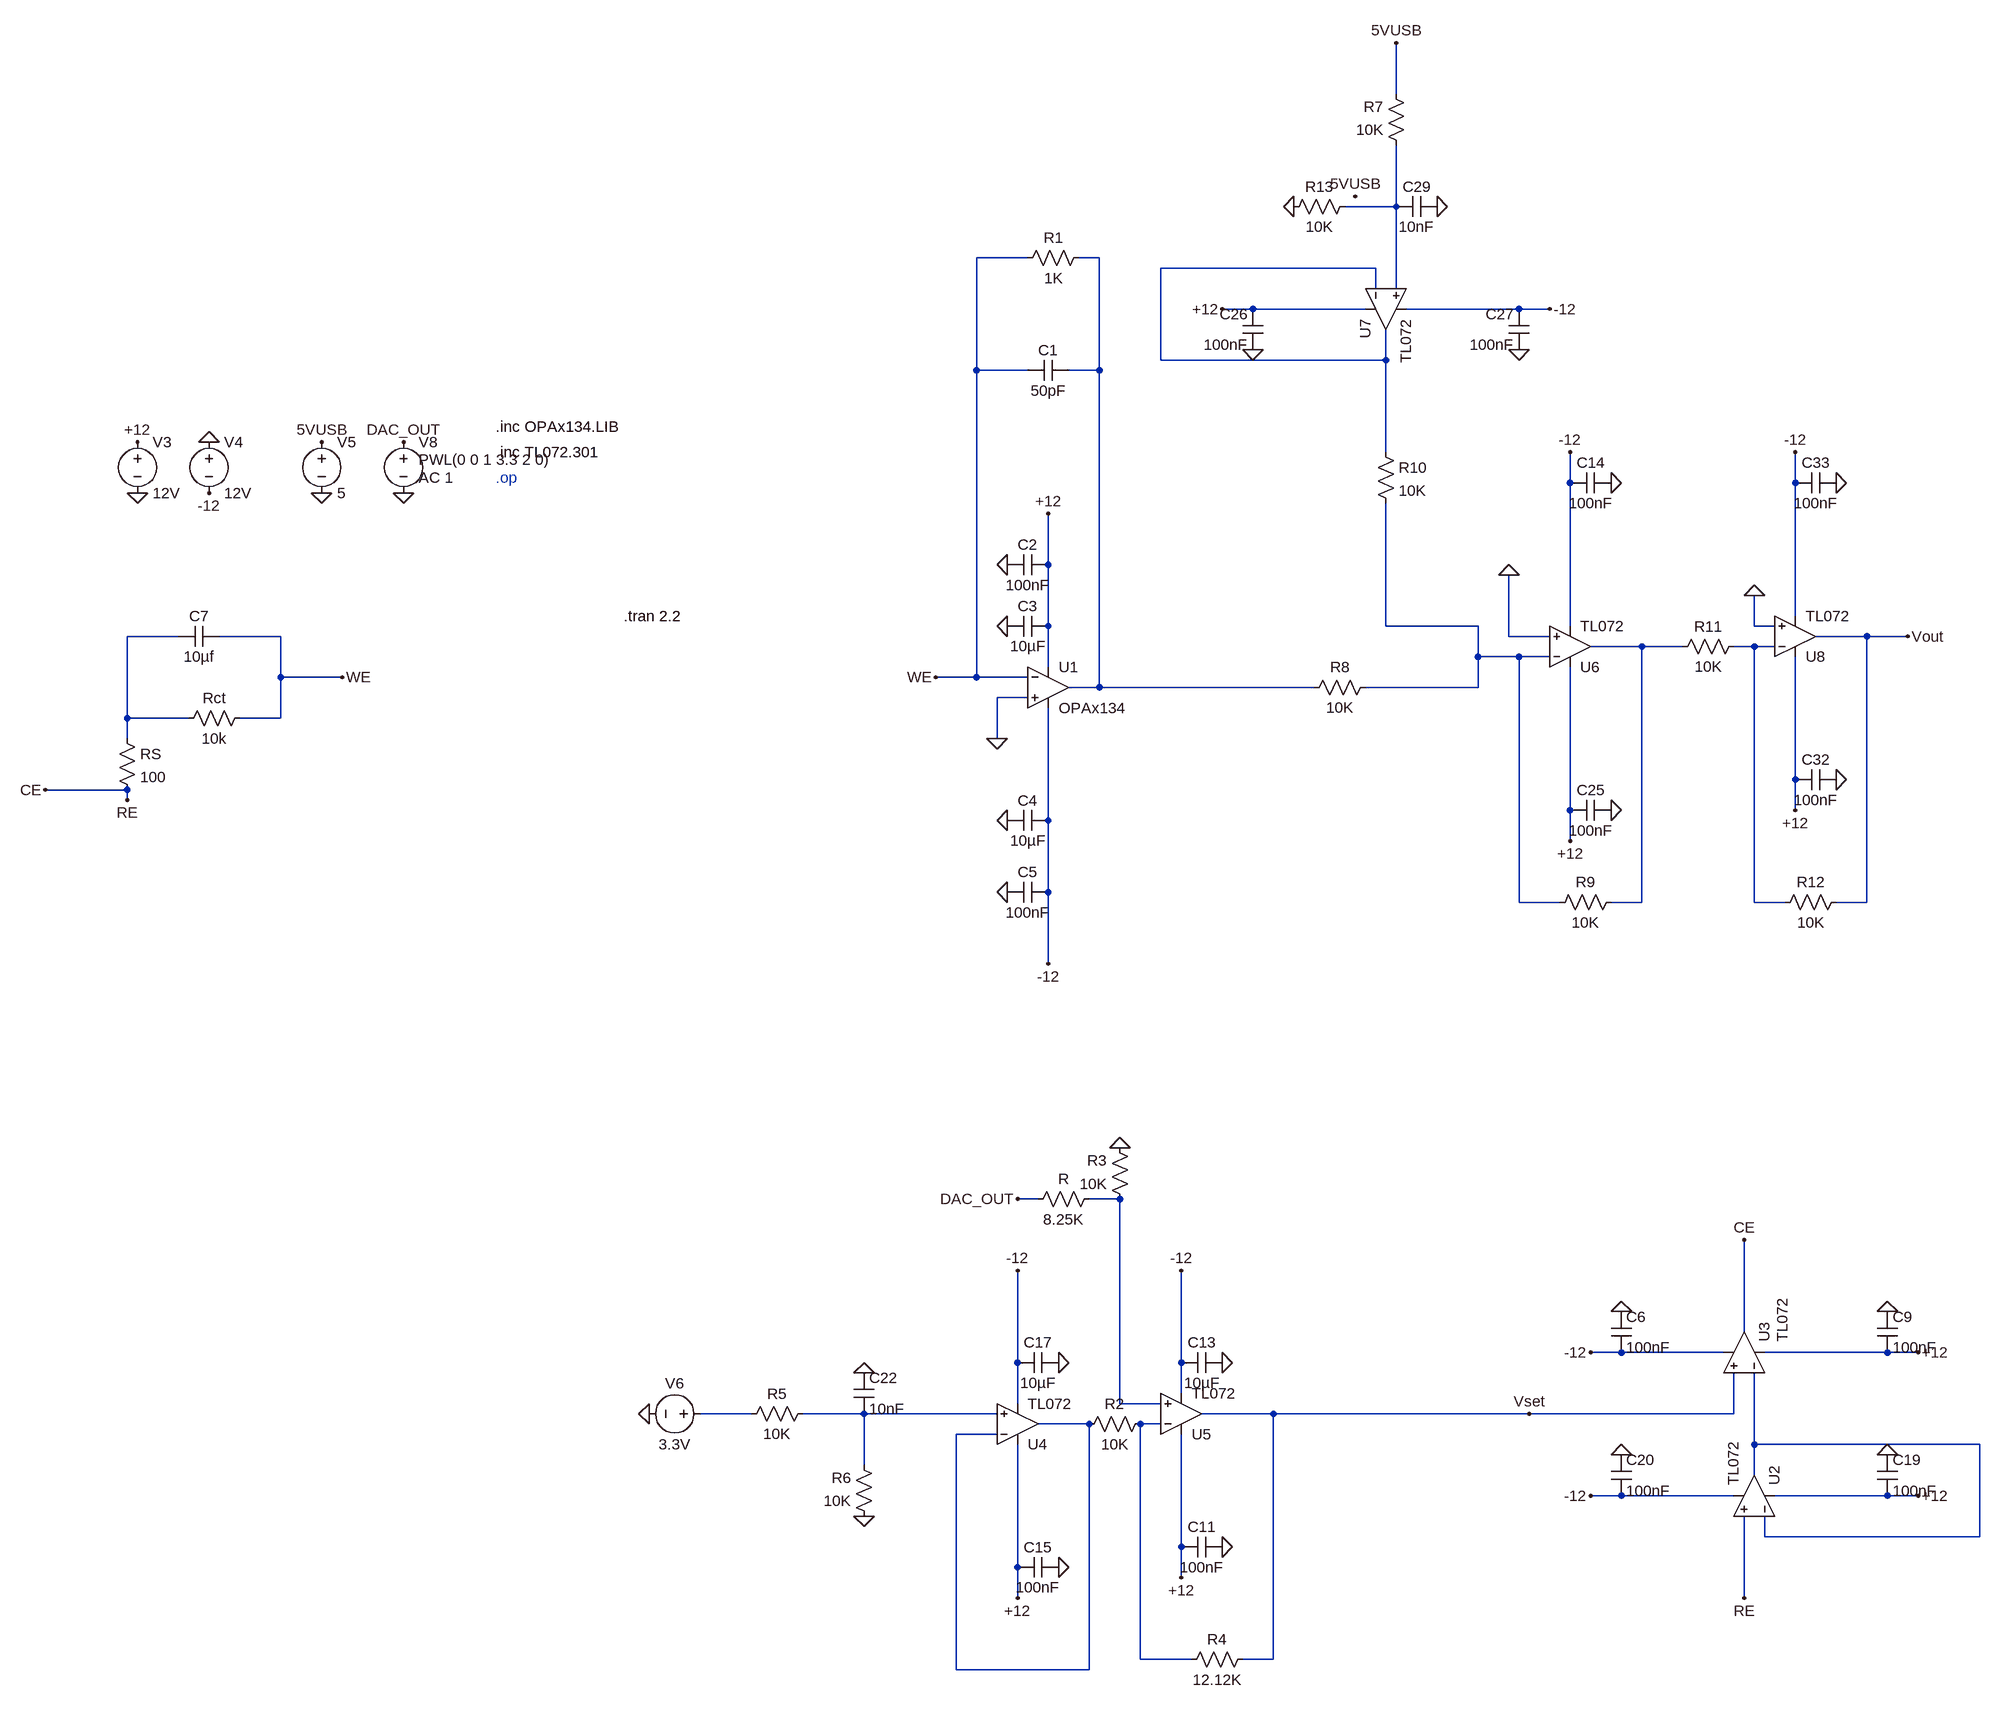
[diagram p0: schematic RandlesCell_DC_2.asc]
RandlesCell_DC_2.asc, the LTspice schematic file:
Version 4.1
SHEET 1 3064 1480
WIRE 1072 -1200 1072 -1280
WIRE 1072 -1024 1072 -1120
WIRE 1072 -1024 992 -1024
WIRE 496 -944 416 -944
WIRE 608 -944 576 -944
WIRE 1040 -928 704 -928
WIRE 1040 -896 1040 -928
WIRE 1072 -896 1072 -1024
WIRE 848 -864 800 -864
WIRE 1024 -864 848 -864
WIRE 1264 -864 1088 -864
WIRE 1312 -864 1264 -864
WIRE 704 -784 704 -928
WIRE 1056 -784 1056 -832
WIRE 1056 -784 704 -784
WIRE 416 -768 416 -944
WIRE 496 -768 416 -768
WIRE 608 -768 608 -944
WIRE 608 -768 560 -768
WIRE 1056 -640 1056 -784
WIRE 1344 -592 1344 -640
WIRE 1696 -592 1696 -640
WIRE 528 -464 528 -544
WIRE 1696 -384 1696 -592
WIRE 528 -368 528 -464
WIRE 1056 -368 1056 -560
WIRE 1200 -368 1056 -368
WIRE 1344 -368 1344 -592
WIRE 1632 -368 1632 -416
WIRE 1664 -368 1632 -368
WIRE -832 -352 -912 -352
WIRE -672 -352 -768 -352
WIRE 1248 -352 1248 -448
WIRE 1312 -352 1248 -352
WIRE 1808 -352 1728 -352
WIRE 1872 -352 1808 -352
WIRE 1456 -336 1376 -336
WIRE 1520 -336 1456 -336
WIRE 1632 -336 1600 -336
WIRE 1664 -336 1632 -336
WIRE 1200 -320 1200 -368
WIRE 1264 -320 1200 -320
WIRE 1312 -320 1264 -320
WIRE 528 -304 528 -368
WIRE -672 -288 -672 -352
WIRE -576 -288 -672 -288
WIRE 416 -288 416 -768
WIRE 416 -288 352 -288
WIRE 496 -288 416 -288
WIRE 608 -272 608 -768
WIRE 608 -272 560 -272
WIRE 944 -272 608 -272
WIRE 1200 -272 1200 -320
WIRE 1200 -272 1024 -272
WIRE 496 -256 448 -256
WIRE -912 -224 -912 -352
WIRE -816 -224 -912 -224
WIRE -672 -224 -672 -288
WIRE -672 -224 -736 -224
WIRE -912 -192 -912 -224
WIRE 448 -192 448 -256
WIRE 1696 -128 1696 -320
WIRE -912 -112 -1040 -112
WIRE -912 -96 -912 -112
WIRE 1344 -80 1344 -304
WIRE 1696 -80 1696 -128
WIRE 528 -64 528 -240
WIRE 1344 -32 1344 -80
WIRE 528 48 528 -64
WIRE 1264 64 1264 -320
WIRE 1328 64 1264 64
WIRE 1456 64 1456 -336
WIRE 1456 64 1408 64
WIRE 1632 64 1632 -336
WIRE 1680 64 1632 64
WIRE 1808 64 1808 -352
WIRE 1808 64 1760 64
WIRE 528 160 528 48
WIRE 512 528 480 528
WIRE 640 528 592 528
WIRE 1616 736 1616 592
WIRE 1424 768 1376 768
WIRE 1584 768 1424 768
WIRE 1840 768 1648 768
WIRE 1888 768 1840 768
WIRE 480 784 480 640
WIRE 736 784 736 640
WIRE 736 832 736 784
WIRE 480 848 480 784
WIRE 640 848 640 528
WIRE 704 848 640 848
WIRE 64 864 -16 864
WIRE 240 864 144 864
WIRE 448 864 240 864
WIRE 880 864 768 864
WIRE 1280 864 880 864
WIRE 1600 864 1600 800
WIRE 1600 864 1280 864
WIRE 592 880 512 880
WIRE 704 880 672 880
WIRE 448 896 384 896
WIRE 1632 912 1632 800
WIRE 1984 912 1632 912
WIRE 240 944 240 864
WIRE 1632 960 1632 912
WIRE 1424 992 1376 992
WIRE 1600 992 1424 992
WIRE 1840 992 1664 992
WIRE 1888 992 1840 992
WIRE 1648 1056 1648 1024
WIRE 1984 1056 1984 912
WIRE 1984 1056 1648 1056
WIRE 736 1072 736 896
WIRE 480 1104 480 912
WIRE 736 1120 736 1072
WIRE 480 1152 480 1104
WIRE 1616 1152 1616 1024
WIRE 672 1248 672 880
WIRE 752 1248 672 1248
WIRE 880 1248 880 864
WIRE 880 1248 832 1248
WIRE 384 1264 384 896
WIRE 592 1264 592 880
WIRE 592 1264 384 1264
FLAG 464 -464 0
FLAG 464 -368 0
FLAG 464 -64 0
FLAG 464 48 0
FLAG 1376 768 -12
FLAG 1888 768 +12
FLAG 1616 1152 RE
FLAG 1616 592 CE
FLAG -896 -576 0
FLAG -784 -656 0
FLAG -896 -656 +12
FLAG -784 -576 -12
FLAG 736 1120 +12
FLAG 736 640 -12
FLAG 480 1152 +12
FLAG 480 640 -12
FLAG 1888 992 +12
FLAG 1376 992 -12
FLAG 480 528 DAC_OUT
FLAG 640 448 0
FLAG -96 864 0
FLAG 240 1024 0
FLAG 240 800 0
FLAG -480 -576 0
FLAG -480 -656 DAC_OUT
FLAG 1424 928 0
FLAG 1424 704 0
FLAG 1840 704 0
FLAG 1840 928 0
FLAG 800 784 0
FLAG 800 1072 0
FLAG 544 1104 0
FLAG 544 784 0
FLAG 448 -192 0
FLAG -608 -576 0
FLAG -608 -656 5VUSB
FLAG 1344 -640 -12
FLAG 1408 -592 0
FLAG 1344 -32 +12
FLAG 1408 -80 0
FLAG 1248 -448 0
FLAG 1632 -416 0
FLAG 1872 -352 Vout
FLAG 1696 -80 +12
FLAG 1760 -128 0
FLAG 1696 -640 -12
FLAG 1760 -592 0
FLAG 800 -864 +12
FLAG 1312 -864 -12
FLAG 1264 -800 0
FLAG 848 -800 0
FLAG 912 -1024 0
FLAG 1136 -1024 0
FLAG 1008 -1040 5VUSB
FLAG 1072 -1280 5VUSB
FLAG 352 -288 WE
FLAG -576 -288 WE
FLAG -912 -96 RE
FLAG 1280 864 Vset
FLAG 528 160 -12
FLAG 528 -544 +12
FLAG -1040 -112 CE
SYMBOL cap 560 -784 R90
WINDOW 0 0 32 VBottom 2
WINDOW 3 32 32 VTop 2
SYMATTR InstName C1
SYMATTR Value 50pF
SYMBOL res 592 -960 R90
WINDOW 0 0 56 VBottom 2
WINDOW 3 32 56 VTop 2
SYMATTR InstName R1
SYMATTR Value 1K
SYMBOL cap 528 -480 R90
WINDOW 0 0 32 VBottom 2
WINDOW 3 32 32 VTop 2
SYMATTR InstName C2
SYMATTR Value 100nF
SYMBOL cap 528 -384 R90
WINDOW 0 0 32 VBottom 2
WINDOW 3 32 32 VTop 2
SYMATTR InstName C3
SYMATTR Value 10µF
SYMBOL cap 528 -80 R90
WINDOW 0 0 32 VBottom 2
WINDOW 3 32 32 VTop 2
SYMATTR InstName C4
SYMATTR Value 10µF
SYMBOL cap 528 32 R90
WINDOW 0 0 32 VBottom 2
WINDOW 3 32 32 VTop 2
SYMATTR InstName C5
SYMATTR Value 100nF
SYMBOL OpAmps\\opamp2 528 -336 R0
SYMATTR InstName U1
SYMATTR Value OPAx134
SYMBOL OpAmps\\opamp2 1696 992 M270
SYMATTR InstName U2
SYMATTR Value TL072
SYMBOL OpAmps\\opamp2 1680 768 M270
WINDOW 3 16 4 Left 2
SYMATTR Value TL072
SYMATTR InstName U3
SYMBOL voltage -896 -672 R0
WINDOW 123 0 0 Left 0
WINDOW 39 0 0 Left 0
SYMATTR InstName V3
SYMATTR Value 12V
SYMBOL voltage -784 -672 R0
SYMATTR InstName V4
SYMATTR Value 12V
SYMBOL cap 1408 704 R0
SYMATTR InstName C6
SYMATTR Value 100nF
SYMBOL cap 1824 704 R0
SYMATTR InstName C9
SYMATTR Value 100nF
SYMBOL OpAmps\\opamp2 480 944 M180
SYMATTR InstName U4
SYMATTR Value TL072
SYMBOL OpAmps\\opamp2 736 928 M180
SYMATTR InstName U5
SYMATTR Value TL072
SYMBOL cap 800 1056 R90
WINDOW 0 0 32 VBottom 2
WINDOW 3 32 32 VTop 2
SYMATTR InstName C11
SYMATTR Value 100nF
SYMBOL cap 800 768 R90
WINDOW 0 0 32 VBottom 2
WINDOW 3 32 32 VTop 2
SYMATTR InstName C13
SYMATTR Value 10µF
SYMBOL cap 544 1088 R90
WINDOW 0 0 32 VBottom 2
WINDOW 3 32 32 VTop 2
SYMATTR InstName C15
SYMATTR Value 100nF
SYMBOL cap 544 768 R90
WINDOW 0 0 32 VBottom 2
WINDOW 3 32 32 VTop 2
SYMATTR InstName C17
SYMATTR Value 10µF
SYMBOL cap 1824 928 R0
SYMATTR InstName C19
SYMATTR Value 100nF
SYMBOL cap 1408 928 R0
SYMATTR InstName C20
SYMATTR Value 100nF
SYMBOL res 608 512 R90
WINDOW 0 0 56 VBottom 2
WINDOW 3 32 56 VTop 2
SYMATTR InstName R
SYMATTR Value 8.25K
SYMBOL res 656 544 R180
WINDOW 0 36 76 Left 2
WINDOW 3 36 40 Left 2
SYMATTR InstName R3
SYMATTR Value 10K
SYMBOL res 688 864 R90
WINDOW 0 0 56 VBottom 2
WINDOW 3 32 56 VTop 2
SYMATTR InstName R2
SYMATTR Value 10K
SYMBOL res 848 1232 R90
WINDOW 0 0 56 VBottom 2
WINDOW 3 32 56 VTop 2
SYMATTR InstName R4
SYMATTR Value 12.12K
SYMBOL voltage 0 864 R90
WINDOW 0 -32 56 VBottom 2
WINDOW 3 32 56 VTop 2
WINDOW 123 0 0 Left 0
WINDOW 39 0 0 Left 0
SYMATTR InstName V6
SYMATTR Value 3.3V
SYMBOL res 160 848 R90
WINDOW 0 0 56 VBottom 2
WINDOW 3 32 56 VTop 2
SYMATTR InstName R5
SYMATTR Value 10K
SYMBOL res 256 1040 R180
WINDOW 0 36 76 Left 2
WINDOW 3 36 40 Left 2
SYMATTR InstName R6
SYMATTR Value 10K
SYMBOL cap 224 800 R0
SYMATTR InstName C22
SYMATTR Value 10nF
SYMBOL res -720 -240 R90
WINDOW 0 0 56 VBottom 2
WINDOW 3 32 56 VTop 2
SYMATTR InstName Rct
SYMATTR Value 10k
SYMBOL voltage -480 -672 R0
WINDOW 3 24 44 Left 2
WINDOW 123 24 72 Left 2
WINDOW 39 0 0 Left 0
SYMATTR Value PWL(0 0 1 3.3 2 0)
SYMATTR Value2 AC 1
SYMATTR InstName V8
SYMBOL OpAmps\\opamp2 1344 -272 M180
SYMATTR InstName U6
SYMATTR Value TL072
SYMBOL voltage -608 -672 R0
WINDOW 123 0 0 Left 0
WINDOW 39 0 0 Left 0
SYMATTR InstName V5
SYMATTR Value 5
SYMBOL cap 1408 -608 R90
WINDOW 0 0 32 VBottom 2
WINDOW 3 32 32 VTop 2
SYMATTR InstName C14
SYMATTR Value 100nF
SYMBOL cap 1408 -96 R90
WINDOW 0 0 32 VBottom 2
WINDOW 3 32 32 VTop 2
SYMATTR InstName C25
SYMATTR Value 100nF
SYMBOL res 1424 48 R90
WINDOW 0 0 56 VBottom 2
WINDOW 3 32 56 VTop 2
SYMATTR InstName R9
SYMATTR Value 10K
SYMBOL res 1504 -320 R270
WINDOW 0 32 56 VTop 2
WINDOW 3 0 56 VBottom 2
SYMATTR InstName R11
SYMATTR Value 10K
SYMBOL OpAmps\\opamp2 1696 -288 M180
SYMATTR InstName U8
SYMATTR Value TL072
SYMBOL res 1664 80 R270
WINDOW 0 32 56 VTop 2
WINDOW 3 0 56 VBottom 2
SYMATTR InstName R12
SYMATTR Value 10K
SYMBOL cap 1760 -144 R90
WINDOW 0 0 32 VBottom 2
WINDOW 3 32 32 VTop 2
SYMATTR InstName C32
SYMATTR Value 100nF
SYMBOL cap 1760 -608 R90
WINDOW 0 0 32 VBottom 2
WINDOW 3 32 32 VTop 2
SYMATTR InstName C33
SYMATTR Value 100nF
SYMBOL res 1040 -288 R90
WINDOW 0 0 56 VBottom 2
WINDOW 3 32 56 VTop 2
SYMATTR InstName R8
SYMATTR Value 10K
SYMBOL OpAmps\\opamp2 992 -864 M90
SYMATTR InstName U7
SYMATTR Value TL072
SYMBOL cap 864 -800 R180
WINDOW 0 24 56 Left 2
WINDOW 3 24 8 Left 2
SYMATTR InstName C26
SYMATTR Value 100nF
SYMBOL cap 1280 -800 R180
WINDOW 0 24 56 Left 2
WINDOW 3 24 8 Left 2
SYMATTR InstName C27
SYMATTR Value 100nF
SYMBOL res 1040 -656 R0
SYMATTR InstName R10
SYMATTR Value 10K
SYMBOL res 1088 -1104 R180
WINDOW 0 36 76 Left 2
WINDOW 3 36 40 Left 2
SYMATTR InstName R7
SYMATTR Value 10K
SYMBOL res 896 -1008 R270
WINDOW 0 32 56 VTop 2
WINDOW 3 0 56 VBottom 2
SYMATTR InstName R13
SYMATTR Value 10K
SYMBOL cap 1136 -1040 R90
WINDOW 0 0 32 VBottom 2
WINDOW 3 32 32 VTop 2
SYMATTR InstName C29
SYMATTR Value 10nF
SYMBOL cap -768 -368 R90
WINDOW 0 0 32 VBottom 2
WINDOW 3 32 32 VTop 2
SYMATTR InstName C7
SYMATTR Value 10µf
SYMBOL res -928 -208 R0
SYMATTR InstName RS
SYMATTR Value 100
TEXT -336 -680 Left 2 !.inc OPAx134.LIB
TEXT -336 -640 Left 2 !.inc TL072.301
TEXT -336 -600 Left 2 ;.op
TEXT -136 -384 Left 2 !.tran 2.2

The netlist it stands for:
* RandlesCell_DC_2.asc
C1 N002 WE 50pF
R1 N002 WE 1K
C2 +12 0 100nF
C3 +12 0 10µF
C4 -12 0 10µF
C5 -12 0 100nF
X§U1 0 WE +12 -12 N002 OPAx134  ; pins In+ In- V+ V- OUT
X§U2 CE N013 +12 -12 N013 TL072  ; pins In+ In- V+ V- OUT
X§U3 Vset N013 +12 -12 CE TL072  ; pins In+ In- V+ V- OUT
V3 +12 0 12V
V4 0 -12 12V
C6 0 -12 100nF
C9 0 +12 100nF
X§U4 N010 N011 +12 -12 N011 TL072  ; pins In+ In- V+ V- OUT
X§U5 N008 N012 +12 -12 Vset TL072  ; pins In+ In- V+ V- OUT
C11 0 +12 100nF
C13 0 -12 10µF
C15 0 +12 100nF
C17 0 -12 10µF
C19 0 +12 100nF
C20 0 -12 100nF
R N008 DAC_OUT 8.25K
R3 N008 0 10K
R2 N012 N011 10K
R4 Vset N012 12.12K
V6 N009 0 3.3V
R5 N010 N009 10K
R6 0 N010 10K
C22 0 N010 10nF
Rct WE N005 10k
V8 DAC_OUT 0 PWL(0 0 1 3.3 2 0) AC 1
X§U6 0 N004 +12 -12 N006 TL072  ; pins In+ In- V+ V- OUT
V5 5VUSB 0 5
C14 0 -12 100nF
C25 0 +12 100nF
R9 N006 N004 10K
R11 N006 N007 10K
X§U8 0 N007 +12 -12 Vout TL072  ; pins In+ In- V+ V- OUT
R12 N007 Vout 10K
C32 0 +12 100nF
C33 0 -12 100nF
R8 N004 N002 10K
X§U7 N001 N003 +12 -12 N003 TL072  ; pins In+ In- V+ V- OUT
C26 0 +12 100nF
C27 0 -12 100nF
R10 N003 N004 10K
R7 N001 5VUSB 10K
R13 0 N001 10K
C29 0 N001 10nF
C7 WE N005 10µf
RS N005 CE 100
.inc OPAx134.LIB
.inc TL072.301
* .op
.tran 2.2
.backanno
.end